# Altium project ADC-DAC Dev Board.PrjPcb
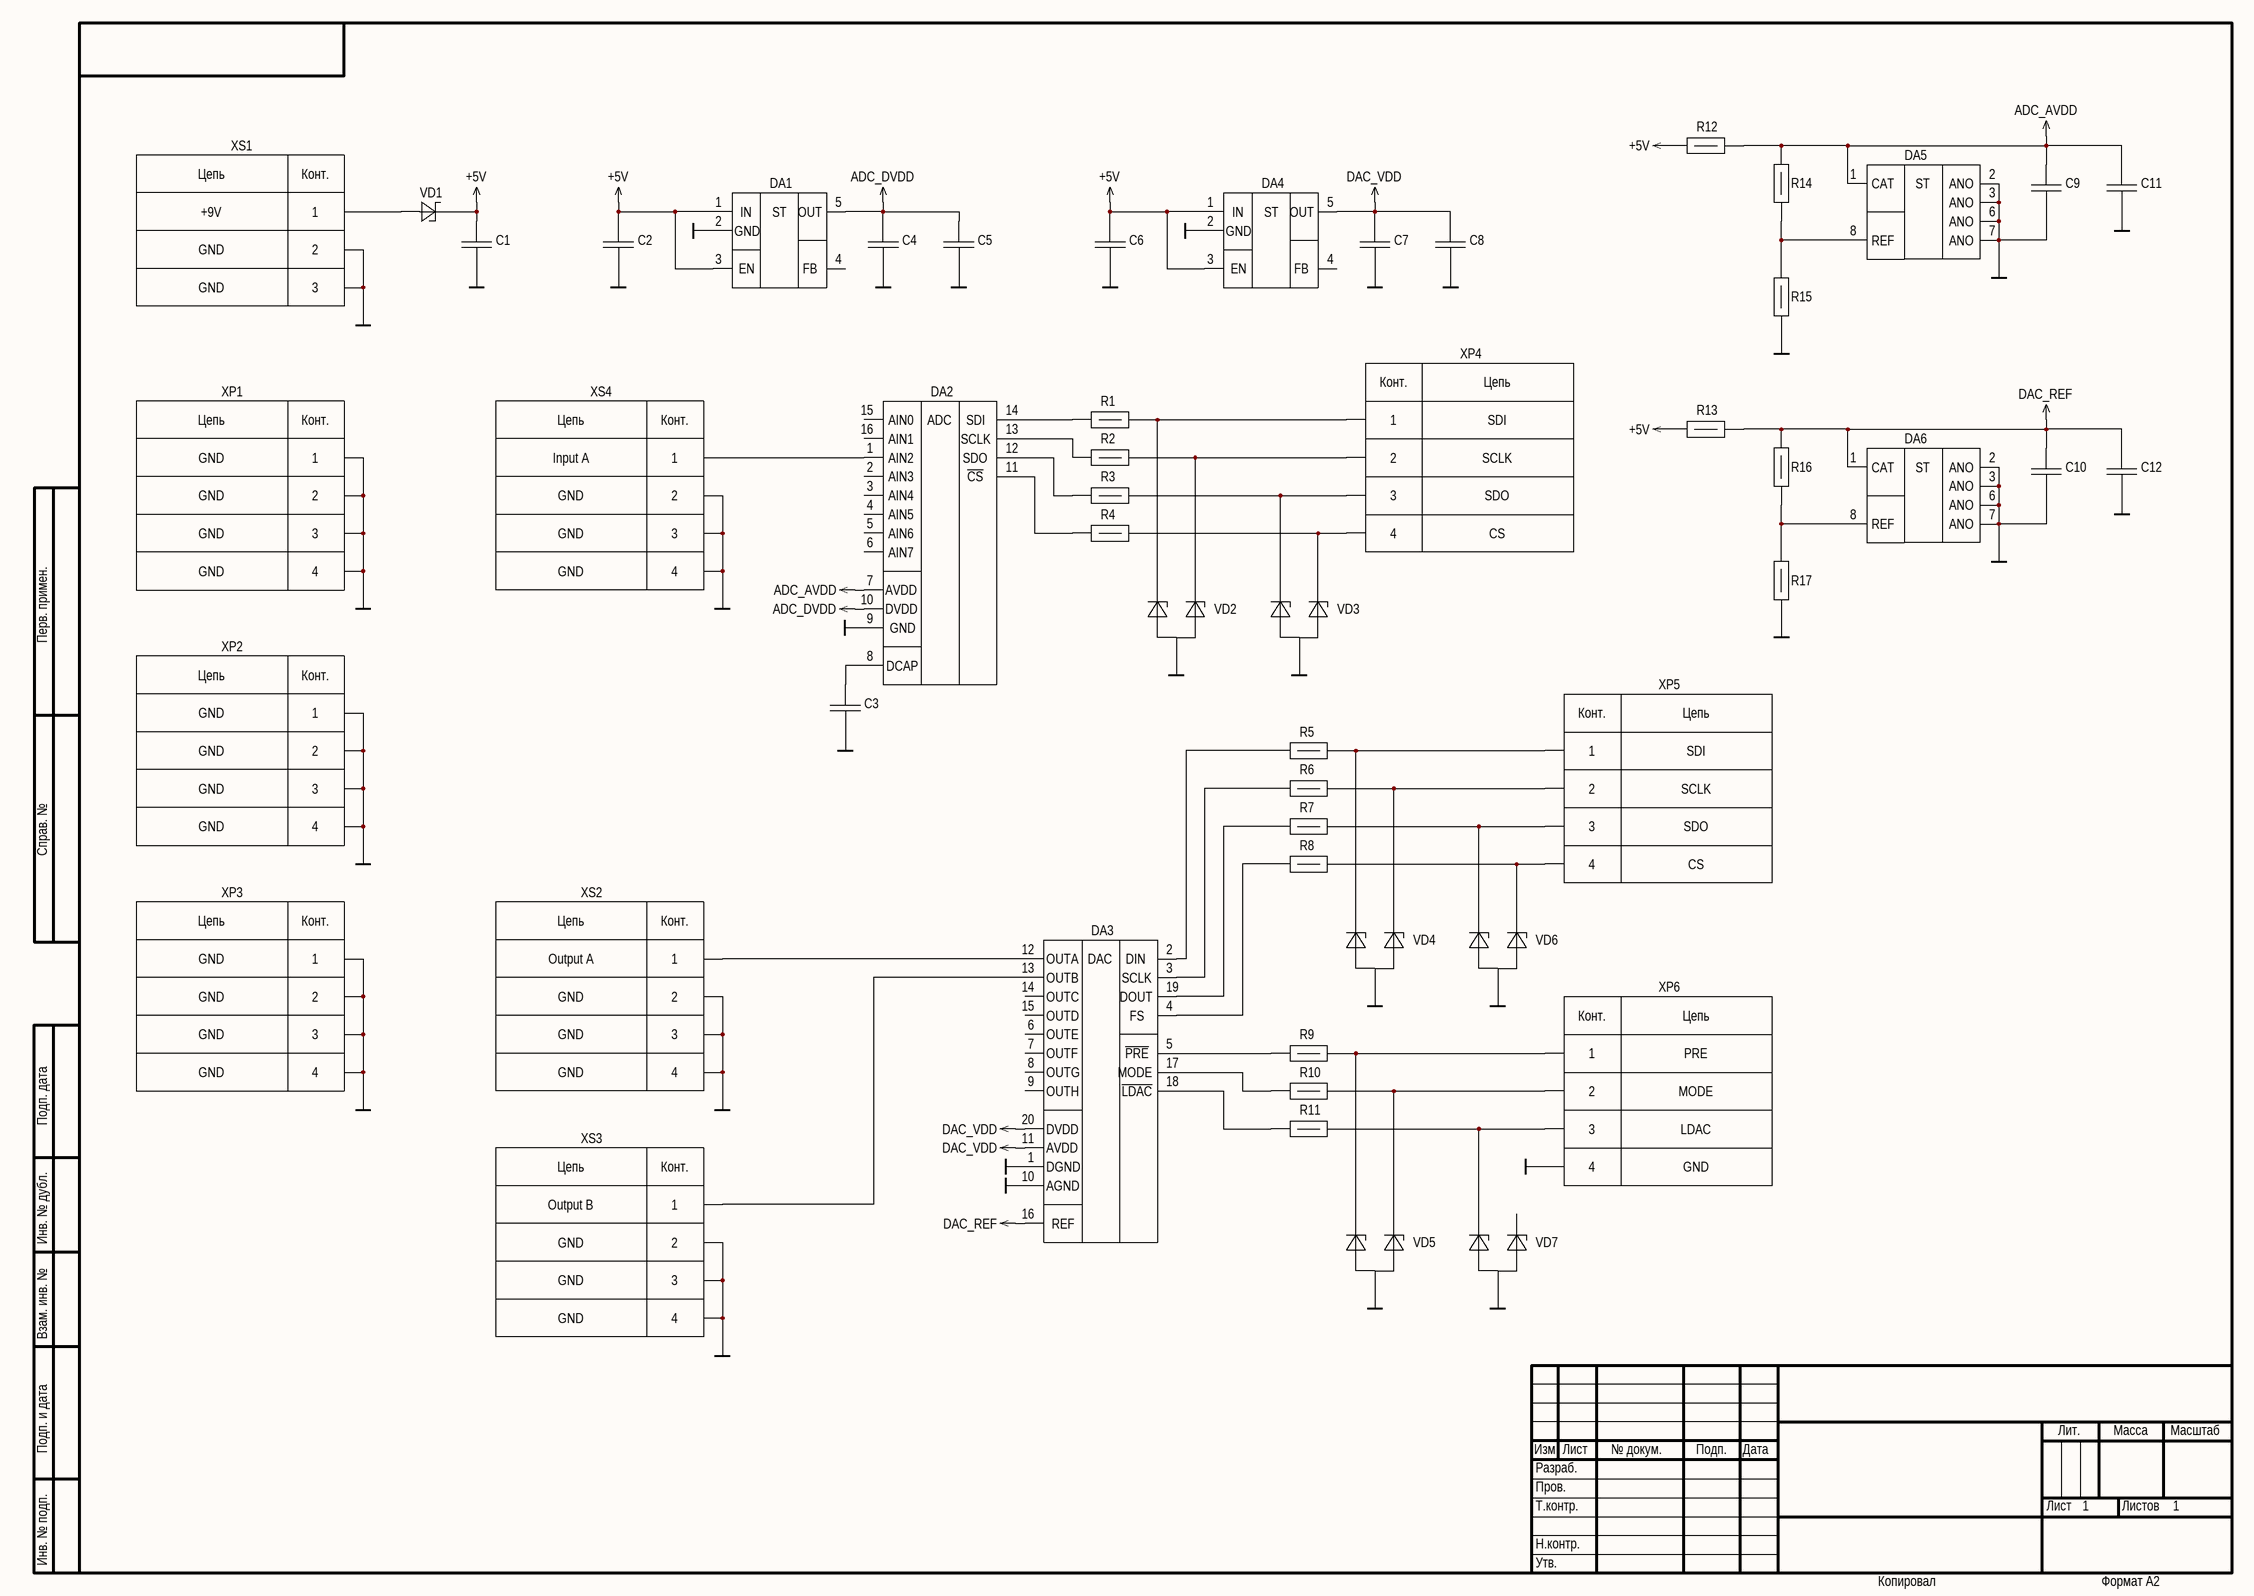
[diagram p0: Schematic.SchDoc]
1 sheet, 52 parts. Net scope: global (net labels, ports and power ports of the same name join across sheets).
Board file: Board.PcbDoc

## Sheet Schematic.SchDoc
size 594 x 420 mm; SheetNumber: 1; SheetTotal: 1

### Parts
C1  10 uF x 10 V  [CAPC2012X06N]  (value not drawn)
C2  10 uF x 10 V  [CAPC2012X06N]  (value not drawn)
C3  1 uF x 50 V  [CAPC2012X06N]  (value not drawn)
C4  10 uF x 10 V  [CAPC2012X06N]  (value not drawn)
C5  1 uF x 50 V  [CAPC2012X06N]  (value not drawn)
C6  10 uF x 10 V  [CAPC2012X06N]  (value not drawn)
C7  10 uF x 10 V  [CAPC2012X06N]  (value not drawn)
C8  1 uF x 50 V  [CAPC2012X06N]  (value not drawn)
C9  1 uF x 50 V  [CAPC2012X06N]  (value not drawn)
C10  1 uF x 50 V  [CAPC2012X06N]  (value not drawn)
C11  10 uF x 10 V  [CAPC2012X06N]  (value not drawn)
C12  10 uF x 10 V  [CAPC2012X06N]  (value not drawn)
DA1  TPS76333DBVT  [DBV0005A]  (value not drawn)
DA2  ADS7038IRTET  [RTE0016C]  (value not drawn)
DA3  TLV5631IPW  [PW0020A]  (value not drawn)
DA4  TPS76333DBVT  [DBV0005A]  (value not drawn)
DA5  TL431AID  [D0008A]  (value not drawn)
DA6  TL431AID  [D0008A]  (value not drawn)
R1  22 Ohms  [RESC2012X06N]  (value not drawn)
R2  22 Ohms  [RESC2012X06N]  (value not drawn)
R3  22 Ohms  [RESC2012X06N]  (value not drawn)
R4  22 Ohms  [RESC2012X06N]  (value not drawn)
R5  22 Ohms  [RESC2012X06N]  (value not drawn)
R6  22 Ohms  [RESC2012X06N]  (value not drawn)
R7  22 Ohms  [RESC2012X06N]  (value not drawn)
R8  22 Ohms  [RESC2012X06N]  (value not drawn)
R9  22 Ohms  [RESC2012X06N]  (value not drawn)
R10  22 Ohms  [RESC2012X06N]  (value not drawn)
R11  22 Ohms  [RESC2012X06N]  (value not drawn)
R12  182 Ohms  [RESC2012X06N]  (value not drawn)
R13  182 Ohms  [RESC2012X06N]  (value not drawn)
R14  3.3 kOhms  [RESC2012X06N]  (value not drawn)
R15  10 kOhms  [RESC2012X06N]  (value not drawn)
R16  3.3 kOhms  [RESC2012X06N]  (value not drawn)
R17  10 kOhms  [RESC2012X06N]  (value not drawn)
VD1  BAT54W-HG3-18  [SOD-123]  (value not drawn)
VD2  SP0502BAHT  [SOT23]  (value not drawn)
VD3  SP0502BAHT  [SOT23]  (value not drawn)
VD4  SP0502BAHT  [SOT23]  (value not drawn)
VD5  SP0502BAHT  [SOT23]  (value not drawn)
VD6  SP0502BAHT  [SOT23]  (value not drawn)
VD7  SP0502BAHT  [SOT23]  (value not drawn)
XP1  M20-9770346-4  [HDRV4W64P254_1X4_1016X254X834P]  (value not drawn)
XP2  M20-9770346-4  [HDRV4W64P254_1X4_1016X254X834P]  (value not drawn)
XP3  M20-9770346-4  [HDRV4W64P254_1X4_1016X254X834P]  (value not drawn)
XP4  M20-9770346-4  [HDRV4W64P254_1X4_1016X254X834P]  (value not drawn)
XP5  M20-9770346-4  [HDRV4W64P254_1X4_1016X254X834P]  (value not drawn)
XP6  M20-9770346-4  [HDRV4W64P254_1X4_1016X254X834P]  (value not drawn)
XS1  PJ-002AH  [PJ-002AH (Same Sky)]  (value not drawn)
XS2  0731385003  [0731385003 (Molex)]  (value not drawn)
XS3  0731385003  [0731385003 (Molex)]  (value not drawn)
XS4  0731385003  [0731385003 (Molex)]  (value not drawn)

### Nets
+5V: C1.1 C2.1 C6.1 DA1.1(IN) DA1.3(EN) DA4.1(IN) DA4.3(EN) R12.1 R13.1 VD1.1
ADC_AVDD: C9.1 C11.1 DA2.7(AVDD) DA5.1(CAT) R12.2 R14.2
ADC_DVDD: C4.1 C5.1 DA1.5(OUT) DA2.10(DVDD)
DAC_REF: C10.1 C12.1 DA3.16(REF) DA6.1(CAT) R13.2 R16.2
DAC_VDD: C7.1 C8.1 DA3.11(AVDD) DA3.20(DVDD) DA4.5(OUT)
GND: C1.2 C2.2 C3.2 C4.2 C5.2 C6.2 C7.2 C8.2 C9.2 C10.2 C11.2 C12.2 DA1.2(GND) DA2.9(GND) DA3.1(DGND) DA3.10(AGND) DA4.2(GND) DA5.2(ANO) DA5.3(ANO) DA5.6(ANO) DA5.7(ANO) DA6.2(ANO) DA6.3(ANO) DA6.6(ANO) DA6.7(ANO) R15.1 R17.1 VD2.3 VD3.3 VD4.3 VD5.3 VD6.3 VD7.3 XP1.1(GND) XP1.2(GND) XP1.3(GND) XP1.4(GND) XP2.1(GND) XP2.2(GND) XP2.3(GND) XP2.4(GND) XP3.1(GND) XP3.2(GND) XP3.3(GND) XP3.4(GND) XP6.4(GND) XS1.2(GND) XS1.3(GND) XS2.2(GND) XS2.3(GND) XS2.4(GND) XS3.2(GND) XS3.3(GND) XS3.4(GND) XS4.2(GND) XS4.3(GND) XS4.4(GND)
NetC3_1: C3.1 DA2.8(DCAP)
NetDA2_1: DA2.1(AIN2) XS4.1(Input_A)
NetDA2_11: DA2.11(~{CS}) R4.1
NetDA2_12: DA2.12(SDO) R3.1
NetDA2_13: DA2.13(SCLK) R2.1
NetDA2_14: DA2.14(SDI) R1.1
NetDA3_2: DA3.2(DIN) R5.1
NetDA3_3: DA3.3(SCLK) R6.1
NetDA3_4: DA3.4(FS) R8.1
NetDA3_5: DA3.5(~{PRE}) R9.1
NetDA3_12: DA3.12(OUTA) XS2.1(Output_A)
NetDA3_13: DA3.13(OUTB) XS3.1(Output_B)
NetDA3_17: DA3.17(MODE) R10.1
NetDA3_18: DA3.18(~{LDAC}) R11.1
NetDA3_19: DA3.19(DOUT) R7.1
NetDA5_8: DA5.8(REF) R14.1 R15.2
NetDA6_8: DA6.8(REF) R16.1 R17.2
NetR1_2: R1.2 VD2.2 XP4.1(SDI)
NetR2_2: R2.2 VD2.1 XP4.2(SCLK)
NetR3_2: R3.2 VD3.2 XP4.3(SDO)
NetR4_2: R4.2 VD3.1 XP4.4(~{CS})
NetR5_2: R5.2 VD4.2 XP5.1(SDI)
NetR6_2: R6.2 VD4.1 XP5.2(SCLK)
NetR7_2: R7.2 VD6.2 XP5.3(SDO)
NetR8_2: R8.2 VD6.1 XP5.4(~{CS})
NetR9_2: R9.2 VD5.2 XP6.1(~{PRE})
NetR10_2: R10.2 VD5.1 XP6.2(MODE)
NetR11_2: R11.2 VD7.2 XP6.3(~{LDAC})
NetVD1_2: VD1.2 XS1.1(+9V)

Not connected (* = marked no-connect by the designer): DA1 4(FB); DA2 2(AIN3) 3(AIN4) 4(AIN5) 5(AIN6) 6(AIN7) 15(AIN0) 16(AIN1); DA3 6(OUTE) 7(OUTF) 8(OUTG) 9(OUTH) 14(OUTC) 15(OUTD); DA4 4(FB); VD7 1

### Notes on the sheet
- Перв. примен.
- Справ. №
- Подп. дата
- Инв. № дубл.
- Взам. инв. №
- Подп. и дата
- Изм
- Лист
- № докум.
- Подп.
- Дата
- Лит.
- Масса
- Масштаб
- Разраб.
- Пров.
- Т.контр.
- Листов
- Инв. № подп.
- Н.контр.
- Утв.
- Копировал
- Формат А2
- (in symbol 0731385003) Цепь; Конт.
- (in symbol ADS7038IRTET) ADC
- (in symbol M20-9770346-4) Конт.; Цепь; CS; PRE; LDAC
- (in symbol PJ-002AH) Цепь; Конт.
- (in symbol TL431AID) ST
- (in symbol TLV5631IPW) DAC
- (in symbol TPS76333DBVT) ST

### Library data of the parts
C1 C2 C4 C6 C7 C11 C12 = KGM21AR71A106KU: MLCC - Multilayer Ceramic Capacitors; Capacitance: 10 uF; Voltage Rating: 10 V; Tolerance: 10%; Package: 0805
C3 C5 C8-C10 = KGF21KR71H105KU: MLCC - Multilayer Ceramic Capacitors; Capacitance: 1 uF; Voltage Rating: 50 V; Tolerance: 10%; Package: 0805
DA1 DA4 = TPS76333DBVT: 150mA, 10V, Low-Dropout Voltage Regulator
DA2 = ADS7038IRTET: Small, 8-Channel, 12-Bit ADC With SPI Interface, GPIOs, and CRC
DA3 = TLV5631IPW: 8-CHANNEL, 12-/10-/8-BIT, 2.7-V TO 5.5-V LOW POWER DIGITAL-TO-ANALOG CONVERTERS WITH POWER DOWNANDINTERNAL REFERENCE
R1-R11 = RCA080522R0FKEA: Thick Film Chip Resistors; Tolerance: 1%; Resistance: 22 Ohms; Package: 0805
R12 R13 = CR0805-FX-1820ELF: Thick Film Chip Resistors; Tolerance: 1%; Resistance: 182 Ohms; Package: 0805
R14 R16 = CR0805-FX-3301ELF: Thick Film Chip Resistors; Tolerance: 1%; Resistance: 3.3 kOhms; Package: 0805
R15 R17 = ERJ-6ENF1002V: Thick Film Chip Resistors; Tolerance: 1%; Resistance: 10 kOhms; Package: 0805
VD1 = BAT54W-HG3-18: Schottky Diodes & Rectifiers 30V Schottky DIODE
VD2-VD7 = SP0502BAHT: TVS Diode Array
XP1-XP6 = M20-9770346-4: Header 2.54mm
XS1 = PJ-002AH: DC POWER JACK
XS2-XS4 = 0731385003: BNC Connector Jack